# EAGLE design FiveLEDs (EAGLE 9.6.2)
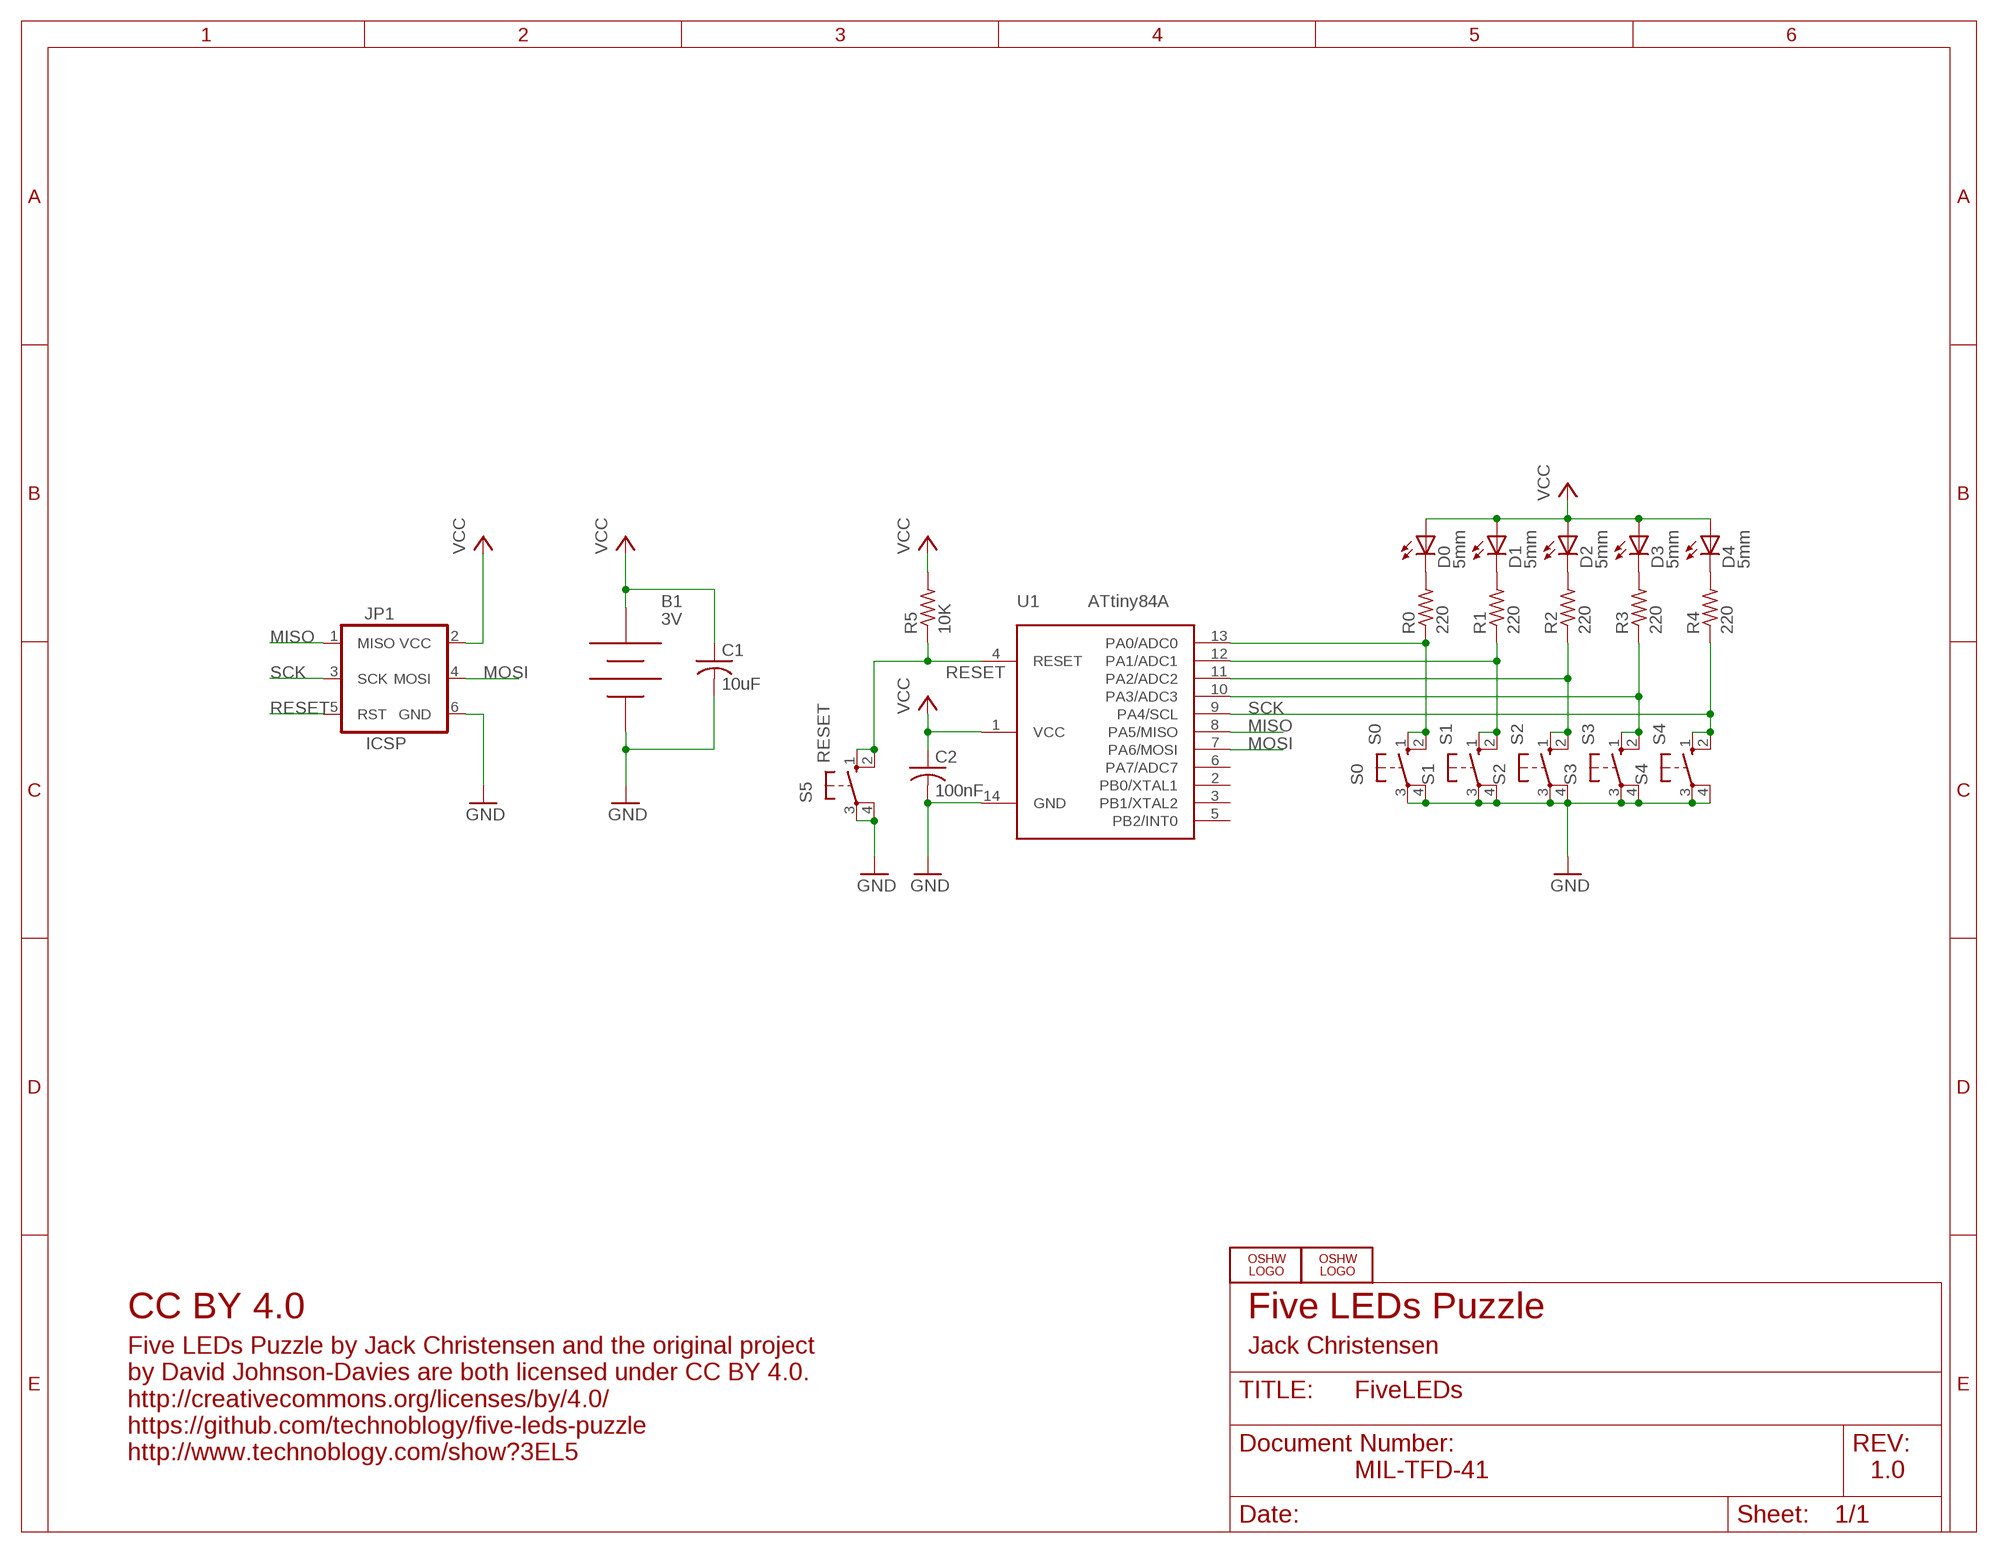
[diagram p0: schematic, sheet 1]

## Parts
B1  3V  BATTERY-2AANOHOLES  [KEYSTONE-2462-NO-HOLES]
C1  10uF  C-USM0805  [M0805]
C2  100nF  C-USM0805  [M0805]
D0  5mm  LED5MM  [LED5MM]
D1  5mm  LED5MM  [LED5MM]
D2  5mm  LED5MM  [LED5MM]
D3  5mm  LED5MM  [LED5MM]
D4  5mm  LED5MM  [LED5MM]
JP1  ICSP  AVR_SPI_PRG_62X3_LOCK  [2X3_LOCK]
LOGO1  OSHW_LOGO_8MILX0150-NT  [OSHW_8X150_NOTEXT]
LOGO3  OSHW_LOGO_8MILX0100-NT  [OSHW_8X100_NOTEXT]
R0  220  R-US_M0805  [M0805]
R1  220  R-US_M0805  [M0805]
R2  220  R-US_M0805  [M0805]
R3  220  R-US_M0805  [M0805]
R4  220  R-US_M0805  [M0805]
R5  10K  R-US_M0805  [M0805]
S0  S0  10-XXOCT  [B3F-10XXOCT]
S1  S1  10-XXOCT  [B3F-10XXOCT]
S2  S2  10-XXOCT  [B3F-10XXOCT]
S3  S3  10-XXOCT  [B3F-10XXOCT]
S4  S4  10-XXOCT  [B3F-10XXOCT]
S5  RESET  10-XXOCT  [B3F-10XXOCT]
U1  ATtiny84A  ATTINYX4SO14  [SO14]

## Nets
GND: B1.NEG C1.2 C2.2 JP1.6(GND) S0.3(P) S0.4(P1) S1.3(P) S1.4(P1) S2.3(P) S2.4(P1) S3.3(P) S3.4(P1) S4.3(P) S4.4(P1) S5.3(P) S5.4(P1) U1.14(GND)
MISO: JP1.1(MISO) U1.8(PA5/MISO)
MOSI: JP1.4(MOSI) U1.7(PA6/MOSI)
N$1: D0.K(C) R0.2
N$2: R0.1 S0.1(S) S0.2(S1) U1.13(PA0/ADC0)
N$3: D1.K(C) R1.2
N$4: R1.1 S1.1(S) S1.2(S1) U1.12(PA1/ADC1)
N$5: D2.K(C) R2.2
N$6: R2.1 S2.1(S) S2.2(S1) U1.11(PA2/ADC2)
N$7: D3.K(C) R3.2
N$8: R3.1 S3.1(S) S3.2(S1) U1.10(PA3/ADC3)
N$9: D4.K(C) R4.2
RESET: JP1.5(RST) R5.1 S5.1(S) S5.2(S1) U1.4(RESET)
SCK: JP1.3(SCK) R4.1 S4.1(S) S4.2(S1) U1.9(PA4/SCL)
VCC: B1.POS C1.1 C2.1 D0.A D1.A D2.A D3.A D4.A JP1.2(VCC) R5.2 U1.1(VCC)
Unconnected: U1.2(PB0/XTAL1) U1.3(PB1/XTAL2) U1.5(PB2/INT0) U1.6(PA7/ADC7)

## Notes on the sheet
- CC BY 4.0 | Five LEDs Puzzle
- Jack Christensen
- Five LEDs Puzzle by Jack Christensen and the original project
  by David Johnson-Davies are both licensed under CC BY 4.0.
  http://creativecommons.org/licenses/by/4.0/
  https://github.com/technoblogy/five-leds-puzzle
  http://www.technoblogy.com/show?3EL5
- MIL-TFD-41 | 1.0

## Library data of the parts
B1 = _jc:BATTERY-2AA
C1 C2 = _jc:C-US: CAPACITOR, American symbol
D0 D1-D4 = _jc:LED: LED OSRAM: - CHIPLED LG R971, LG N971, LY N971, LG Q971, LY Q971, LO R971, LY R971 LH N974, LH R974 LS Q976, LO Q976, LY Q976 LO Q996 - Hyper CHIPLED LW Q18S LB Q993, LB Q99A, LB R99A - SideLED LS A670, LO A670, LY A670, LG A670, LP A670 LB A673, LV A673, LT A673, LW A673 LH A674 LY A675 LS A676, LA A676, LO A676, LY A676, LW A676 LS A679, LY A679, LG A679 - Hyper Micro SIDELED® LS Y876, LA Y876, LO Y876, LY Y876 LT Y87S - SmartLED LW L88C, LW L88S LB L89C, LB L89S, LG L890 LS L89K, LO L89K, LY L89K LS L896, LA L896, LO L896, LY L896 - TOPLED LS T670, LO T670, LY T670, LG T670, LP T670 LSG T670, LSP T670, LSY T670, LOP T670, LYG T670 LG T671, LOG T671, LSG T671 LB T673, LV T673, LT T673, LW T673 LH T674 LS T676, LA T676, LO T676, LY T676, LB T676, LH T676, LSB T676, LW T676 LB T67C, LV T67C, LT T67C, LS T67K, LO T67K, LY T67K, LW E67C LS E67B, LA E67B, LO E67B, LY E67B, LB E67C, LV E67C, LT E67C LW T67C LS T679, LY T679, LG T679 LS T770, LO T770, LY T770, LG T770, LP T770 LB T773, LV T773, LT T773, LW T773 LH T774 LS E675, LA E675, LY E675, LS T675 LS T776, LA T776, LO T776, LY T776, LB T776 LHGB T686 LT T68C, LB T68C - Hyper Mini TOPLED® LB M676 - Mini TOPLED Santana® LG M470 LS M47K, LO M47K, LY M47K Source: http://www.osram.convergy.de/
JP1 = _jc:AVR_SPI_PRG_6: AVR ISP 6 Pin This is the reduced ISP connector for AVR programming. Common on Arduino. This footprint will take up less PCB space and can be used with a 10-pin to 6-pin adapter such as SKU: BOB-08508
LOGO1 LOGO3 = ohw-logo:OSHW_LOGO_8MIL
R0 R1-R5 = _jc:R-US_: RESISTOR, American symbol
S0 S1-S5 = _jc:10-XX: OMRON SWITCH
U1 = _jc:ATTINYX4

## Board
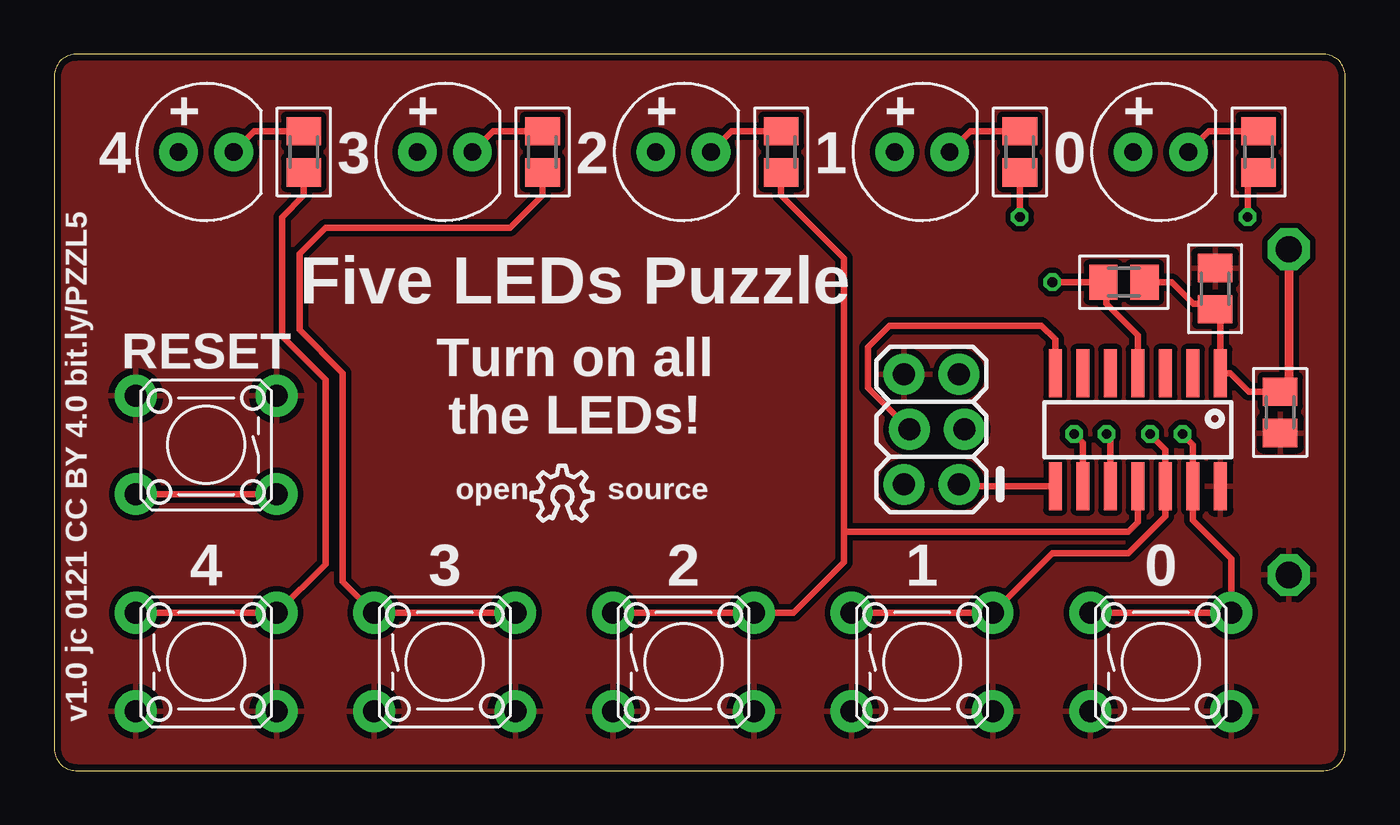
[diagram p1: board, top side]
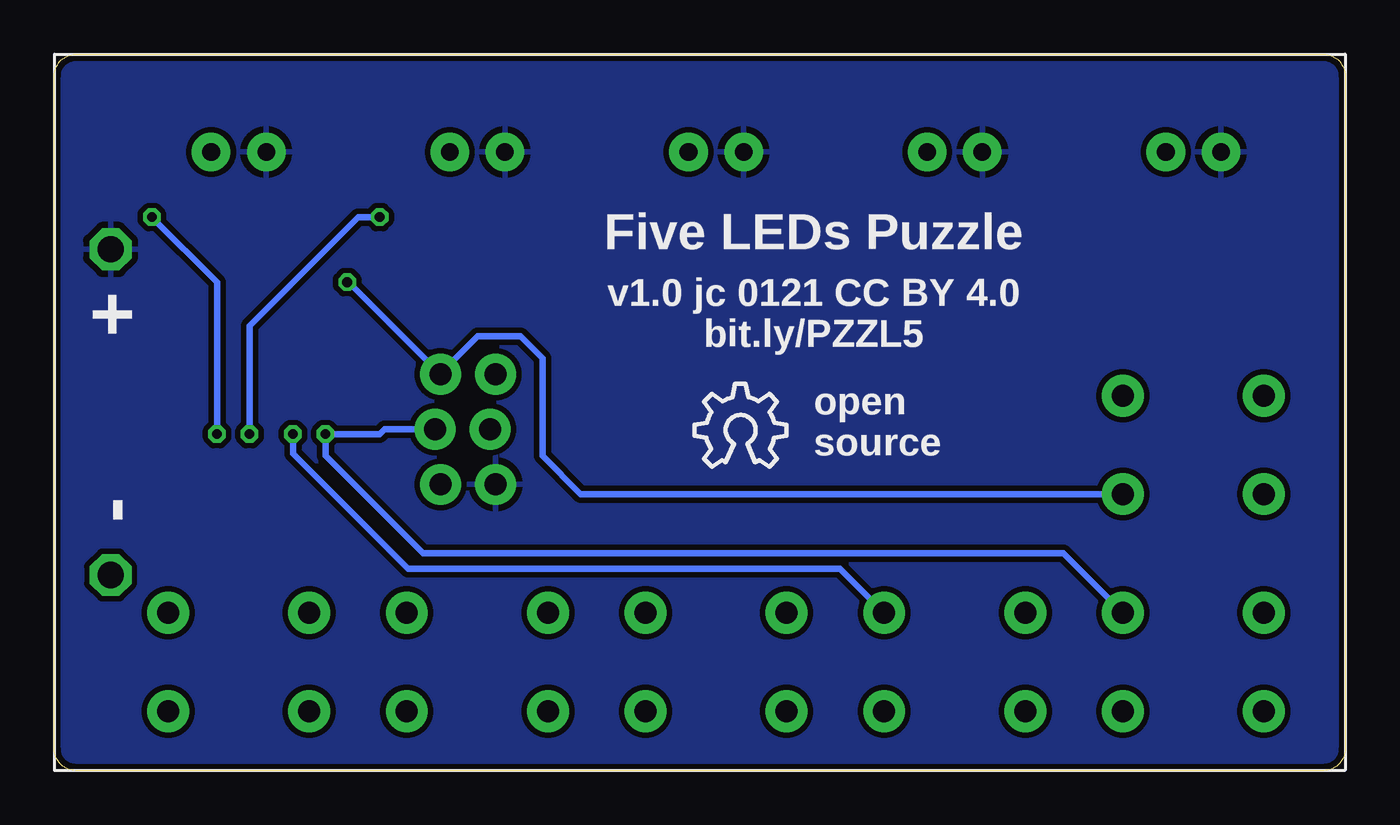
[diagram p2: board, bottom side, seen from below]

Size 59.5 x 33 mm. Coordinates in mm from the lower left corner, seen from the top.
Outline: 58.5,33 1,33 arc90 0,32 0,1 arc90 1,0 58.5,0 arc90 59.5,1 59.5,32 arc90 58.5,33
Copper layers (1*16): Top 0.0356mm / dielectric 1.5011mm / Bottom 0.0356mm
Design rules "oshpark-2layer-jc": minimum track width 8mil, minimum drill 13mil, track to track 8mil, track to pad 8mil, pad to pad 8mil, via to via 8mil, smd to smd 6mil, copper to edge 12mil, drill to drill 6mil, minimum pad ring 7mil, minimum via ring 7mil, stop-mask expansion 2.5mil, vias tented up to drill 20mil, thermal gap 12mil

### Footprints (pad centres in the part's own frame; a part is rotated, then mirrored left to right if it is on the bottom)
KEYSTONE-2462-NO-HOLES = drill 1.2 pad 1.93 octagon: NEG 2.6,-7.5; POS 2.6,7.5
M0805 = smd 1.3 x 1.6: 1 -0.95,0; 2 0.95,0
LED5MM = drill 0.813 pad 1.778: A -1.27,0; K 1.27,0
2X3_LOCK = drill 1.016 pad 1.88: 1 0,0; 2 0,2.54; 3 2.54,-0.254; 4 2.54,2.286; 5 5.08,0; 6 5.08,2.54
B3F-10XXOCT = drill 1.016 pad 1.93: 1 -3.251,2.261; 2 3.251,2.261; 3 -3.251,-2.261; 4 3.251,-2.261
SO14 = smd 0.6 x 2.2: 1 -3.81,-2.6; 2 -2.54,-2.6; 3 -1.27,-2.6; 4 0,-2.6; 5 1.27,-2.6; 6 2.54,-2.6; 7 3.81,-2.6; 8 3.81,2.6; 9 2.54,2.6; 10 1.27,2.6; 11 0,2.6; 12 -1.27,2.6; 13 -2.54,2.6; 14 -3.81,2.6

### Placement (x,y rotation side)
B1  59.5,16.51 0 bottom
C1  56.5,16.5 270 top
C2  53.5,22.2 90 top
D0  51,28.5 0 top
D1  40,28.5 0 top
D2  29,28.5 0 top
D3  18,28.5 0 top
D4  7,28.5 0 top
JP1  41.7,13.18 90 top
LOGO1  30,14 0 bottom
LOGO3  22,11.5 0 top
R0  55.5,28.5 90 top
R1  44.5,28.5 90 top
R2  33.5,28.5 90 top
R3  22.5,28.5 90 top
R4  11.5,28.5 90 top
R5  49.3,22.5 0 top
S0  51,5 0 top
S1  40,5 0 top
S2  29,5 0 top
S3  18,5 0 top
S4  7,5 0 top
S5  7,15 180 top
U1  49.94,15.7 180 top

### Tracks (layer width: path | path; a pad name or v marks a point on that pad's centre or on a via)
GND
  pour Top (isolate 0.254): -1,-1 -1,34 60.5,34 60.5,-1
MISO
  Top 0.305: U1.8 41.78,13.1 JP1.1
MOSI
  Top 0.305: U1.7 46.13,19.87 45.5,20.5 38.5,20.5 37.5,19.5 37.5,17.63 JP1.4
N$1
  Top 0.305: D0.K 53.22,29.45 R0.2
N$2  (via drill 0.45)
  Top 0.305: S0.1 S0.2 54.25,9.75 52.48,11.52 U1.13 52.48,15.02 v52,15.5 | v55,25.5 55,27.05 R0.1
  Bottom 0.305: v52,15.5 52,22.5 v55,25.5
N$3
  Top 0.305: D1.K 42.22,29.45 R1.2
N$4  (via drill 0.45)
  Top 0.305: S1.1 S1.2 45.99,10 49.5,10 51.21,11.71 U1.12 51.21,14.79 v50.5,15.5 | v44.5,25.5 R1.1
  Bottom 0.305: v50.5,15.5 50.5,20.5 45.5,25.5 v44.5,25.5
N$5
  Top 0.305: D2.K 31.22,29.45 R2.2
N$6
  Top 0.305: S2.1 S2.2 34.06,7.26 36.4,9.59 36.4,11 | R2.1 33.5,26.5 36.4,23.61 36.4,11 | U1.11 49.94,11.44 49.5,11 36.4,11
N$7
  Top 0.305: D3.K 20.22,29.45 R3.2
N$8  (via drill 0.45)
  Top 0.305: S3.2 S3.1 13.3,8.71 13.3,18.3 11.3,20.3 11.3,23.8 12.5,25 21,25 22.5,26.5 R3.1 | U1.10 48.67,15.33 v48.5,15.5
  Bottom 0.305: v48.5,15.5 48.5,14.6 43.2,9.3 23.29,9.3 S3.2
N$9
  Top 0.305: D4.K 9.22,29.45 R4.2
RESET  (via drill 0.45)
  Top 0.305: U1.4 49.94,20.06 48.5,21.5 48.5,22.35 R5.1 v46,22.5 | S5.1 S5.2
  Bottom 0.305: JP1.5 41.72,18.28 | 41.72,18.28 45.94,22.5 v46,22.5 | 41.72,18.28 40,20 38,20 37,19 37,14.5 35.24,12.74 S5.1
SCK  (via drill 0.45)
  Top 0.305: S4.1 S4.2 12.5,9.51 12.5,18 10.5,20 10.5,25.5 11.5,26.5 R4.1 | U1.9 47.4,15.1 v47,15.5
  Bottom 0.305: S4.2 12.99,10 42.5,10 47,14.5 v47,15.5 44.5,15.5 44.28,15.72 JP1.3
VCC
  Top 0.305: R5.2 51.5,22.5 52.5,21.5 53.25,21.5 C2.1 53.75,21 U1.1 54.2,18.3 55.05,17.45 C1.1
  Top 0.406: B1.POS 56.9,17.85 C1.1
  pour Bottom (isolate 0.254): -2,-2 -2,35 61.5,35 61.5,-2

### Text on the board
tPlace: 4 | 3 | 2 | 1 | 0 | Five LEDs Puzzle | RESET | Turn on all / the LEDs! | v1.0 jc 0121 CC BY 4.0 bit.ly/PZZL5 | open | source | 4 | 3 | 2 | 1 | 0
bPlace: Five LEDs Puzzle | v1.0 jc 0121 CC BY 4.0 / bit.ly/PZZL5 | open / source